# EAGLE design LED_Board (EAGLE 6.4)
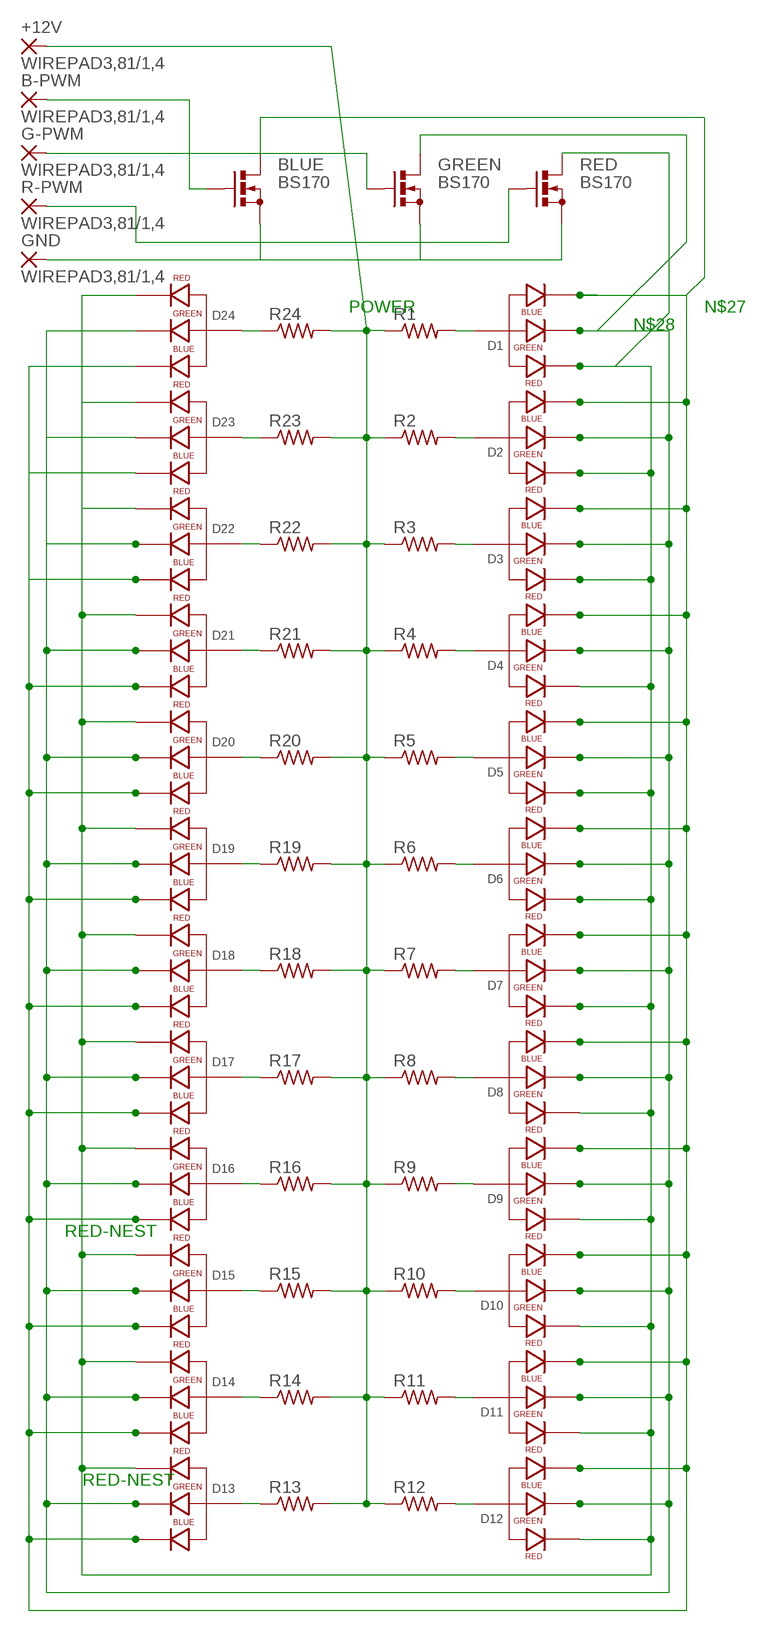
[diagram p0: schematic, sheet 1]

## Parts
+12V  WIREPAD3,81/1,4  [3,81/1,4]
B-PWM  WIREPAD3,81/1,4  [3,81/1,4]
BLUE  BS170  [SOT54E]
D1  LED-RGB-CA-THRUCLEAR  [LED-RGB-THRU]
D2  LED-RGB-CA-THRUCLEAR  [LED-RGB-THRU]
D3  LED-RGB-CA-THRUCLEAR  [LED-RGB-THRU]
D4  LED-RGB-CA-THRUCLEAR  [LED-RGB-THRU]
D5  LED-RGB-CA-THRUCLEAR  [LED-RGB-THRU]
D6  LED-RGB-CA-THRUCLEAR  [LED-RGB-THRU]
D7  LED-RGB-CA-THRUCLEAR  [LED-RGB-THRU]
D8  LED-RGB-CA-THRUCLEAR  [LED-RGB-THRU]
D9  LED-RGB-CA-THRUCLEAR  [LED-RGB-THRU]
D10  LED-RGB-CA-THRUCLEAR  [LED-RGB-THRU]
D11  LED-RGB-CA-THRUCLEAR  [LED-RGB-THRU]
D12  LED-RGB-CA-THRUCLEAR  [LED-RGB-THRU]
D13  LED-RGB-CA-THRUCLEAR  [LED-RGB-THRU]
D14  LED-RGB-CA-THRUCLEAR  [LED-RGB-THRU]
D15  LED-RGB-CA-THRUCLEAR  [LED-RGB-THRU]
D16  LED-RGB-CA-THRUCLEAR  [LED-RGB-THRU]
D17  LED-RGB-CA-THRUCLEAR  [LED-RGB-THRU]
D18  LED-RGB-CA-THRUCLEAR  [LED-RGB-THRU]
D19  LED-RGB-CA-THRUCLEAR  [LED-RGB-THRU]
D20  LED-RGB-CA-THRUCLEAR  [LED-RGB-THRU]
D21  LED-RGB-CA-THRUCLEAR  [LED-RGB-THRU]
D22  LED-RGB-CA-THRUCLEAR  [LED-RGB-THRU]
D23  LED-RGB-CA-THRUCLEAR  [LED-RGB-THRU]
D24  LED-RGB-CA-THRUCLEAR  [LED-RGB-THRU]
G-PWM  WIREPAD3,81/1,4  [3,81/1,4]
GND  WIREPAD3,81/1,4  [3,81/1,4]
GREEN  BS170  [SOT54E]
R1  R-US_0207/10  [0207/10]
R2  R-US_0207/10  [0207/10]
R3  R-US_0207/10  [0207/10]
R4  R-US_0207/10  [0207/10]
R5  R-US_0207/10  [0207/10]
R6  R-US_0207/10  [0207/10]
R7  R-US_0207/10  [0207/10]
R8  R-US_0207/10  [0207/10]
R9  R-US_0207/10  [0207/10]
R10  R-US_0207/10  [0207/10]
R11  R-US_0207/10  [0207/10]
R12  R-US_0207/10  [0207/10]
R13  R-US_0207/10  [0207/10]
R14  R-US_0207/10  [0207/10]
R15  R-US_0207/10  [0207/10]
R16  R-US_0207/10  [0207/10]
R17  R-US_0207/10  [0207/10]
R18  R-US_0207/10  [0207/10]
R19  R-US_0207/10  [0207/10]
R20  R-US_0207/10  [0207/10]
R21  R-US_0207/10  [0207/10]
R22  R-US_0207/10  [0207/10]
R23  R-US_0207/10  [0207/10]
R24  R-US_0207/10  [0207/10]
R-PWM  WIREPAD3,81/1,4  [3,81/1,4]
RED  BS170  [SOT54E]

## Nets
N$1: D4.2(ANODE) R4.2
N$2: BLUE.S GND.1(P) GREEN.S RED.S
N$3: D24.2(ANODE) R24.1
N$4: D23.2(ANODE) R23.1
N$5: D22.2(ANODE) R22.1
N$6: D21.2(ANODE) R21.1
N$7: D20.2(ANODE) R20.1
N$10: D17.2(ANODE) R17.1
N$11: D16.2(ANODE) R16.1
N$12: D15.2(ANODE) R15.1
N$13: D14.2(ANODE) R14.1
N$14: D13.2(ANODE) R13.1
N$15: D1.2(ANODE) R1.2
N$16: D2.2(ANODE) R2.2
N$17: D3.2(ANODE) R3.2
N$19: D5.2(ANODE) R5.2
N$20: D6.2(ANODE) R6.2
N$21: D7.2(ANODE) R7.2
N$22: D8.2(ANODE) R8.2
N$23: D9.2(ANODE) R9.2
N$24: D10.2(ANODE) R10.2
N$25: D12.2(ANODE) R12.2
N$26: D11.2(ANODE) R11.2
N$27: BLUE.D D1.4(BLUE_CATHODE) D2.4(BLUE_CATHODE) D3.4(BLUE_CATHODE) D4.4(BLUE_CATHODE) D5.4(BLUE_CATHODE) D6.4(BLUE_CATHODE) D7.4(BLUE_CATHODE) D8.4(BLUE_CATHODE) D9.4(BLUE_CATHODE) D10.4(BLUE_CATHODE) D11.4(BLUE_CATHODE) D12.4(BLUE_CATHODE) D13.4(BLUE_CATHODE) D14.4(BLUE_CATHODE) D15.4(BLUE_CATHODE) D16.4(BLUE_CATHODE) D17.4(BLUE_CATHODE) D18.4(BLUE_CATHODE) D19.4(BLUE_CATHODE) D20.4(BLUE_CATHODE) D21.4(BLUE_CATHODE) D22.4(BLUE_CATHODE) D23.4(BLUE_CATHODE) D24.4(BLUE_CATHODE)
N$28: D1.3(GREEN_CATHODE) D2.3(GREEN_CATHODE) D3.3(GREEN_CATHODE) D4.3(GREEN_CATHODE) D5.3(GREEN_CATHODE) D6.3(GREEN_CATHODE) D7.3(GREEN_CATHODE) D8.3(GREEN_CATHODE) D9.3(GREEN_CATHODE) D10.3(GREEN_CATHODE) D11.3(GREEN_CATHODE) D12.3(GREEN_CATHODE) D13.3(GREEN_CATHODE) D14.3(GREEN_CATHODE) D15.3(GREEN_CATHODE) D16.3(GREEN_CATHODE) D17.3(GREEN_CATHODE) D18.3(GREEN_CATHODE) D19.3(GREEN_CATHODE) D20.3(GREEN_CATHODE) D21.3(GREEN_CATHODE) D22.3(GREEN_CATHODE) D23.3(GREEN_CATHODE) D24.3(GREEN_CATHODE) GREEN.D
N$30: R-PWM.1(P) RED.G
N$31: G-PWM.1(P) GREEN.G
N$32: B-PWM.1(P) BLUE.G
N$47: D18.2(ANODE) R18.1
N$48: D19.2(ANODE) R19.1
POWER: +12V.1(P) R1.1 R2.1 R3.1 R4.1 R5.1 R6.1 R7.1 R8.1 R9.1 R10.1 R11.1 R12.1 R13.2 R14.2 R15.2 R16.2 R17.2 R18.2 R19.2 R20.2 R21.2 R22.2 R23.2 R24.2
RED-NEST: D1.1(RED_CATHODE) D2.1(RED_CATHODE) D3.1(RED_CATHODE) D4.1(RED_CATHODE) D5.1(RED_CATHODE) D6.1(RED_CATHODE) D7.1(RED_CATHODE) D8.1(RED_CATHODE) D9.1(RED_CATHODE) D10.1(RED_CATHODE) D11.1(RED_CATHODE) D12.1(RED_CATHODE) D13.1(RED_CATHODE) D14.1(RED_CATHODE) D15.1(RED_CATHODE) D16.1(RED_CATHODE) D17.1(RED_CATHODE) D18.1(RED_CATHODE) D19.1(RED_CATHODE) D20.1(RED_CATHODE) D21.1(RED_CATHODE) D22.1(RED_CATHODE) D23.1(RED_CATHODE) D24.1(RED_CATHODE) RED.D

## Library data of the parts
+12V B-PWM G-PWM GND R-PWM = wirepad:WIREPAD: Wire PAD connect wire on PCB
BLUE GREEN RED = transistor-small-signal:BS170: N-CHANNEL MOS FET
D1-D24 = SparkFun-LED:LED-RGB-CA-THRU: RGB Through-hole common anode SparkFun store front COM-10821 (diffuse) COM-10820 (clear); PROD_ID: DIO-10631
R1-R24 = resistor:R-US_: RESISTOR, American symbol

## Board
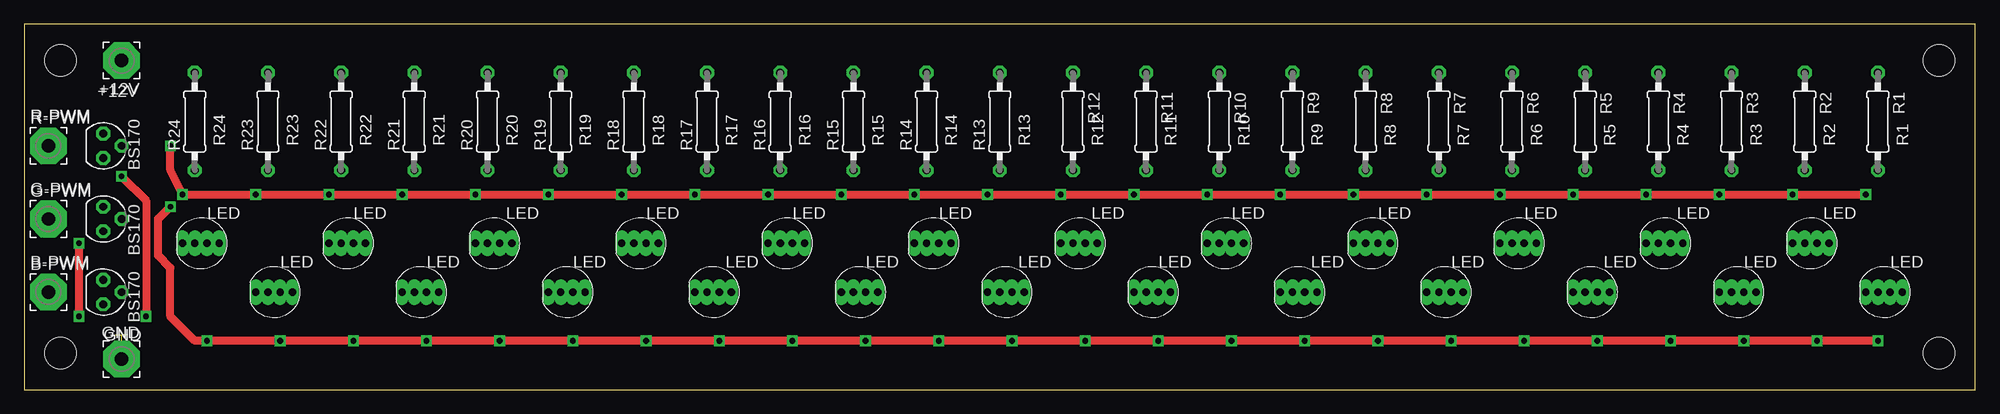
[diagram p1: board, top side]
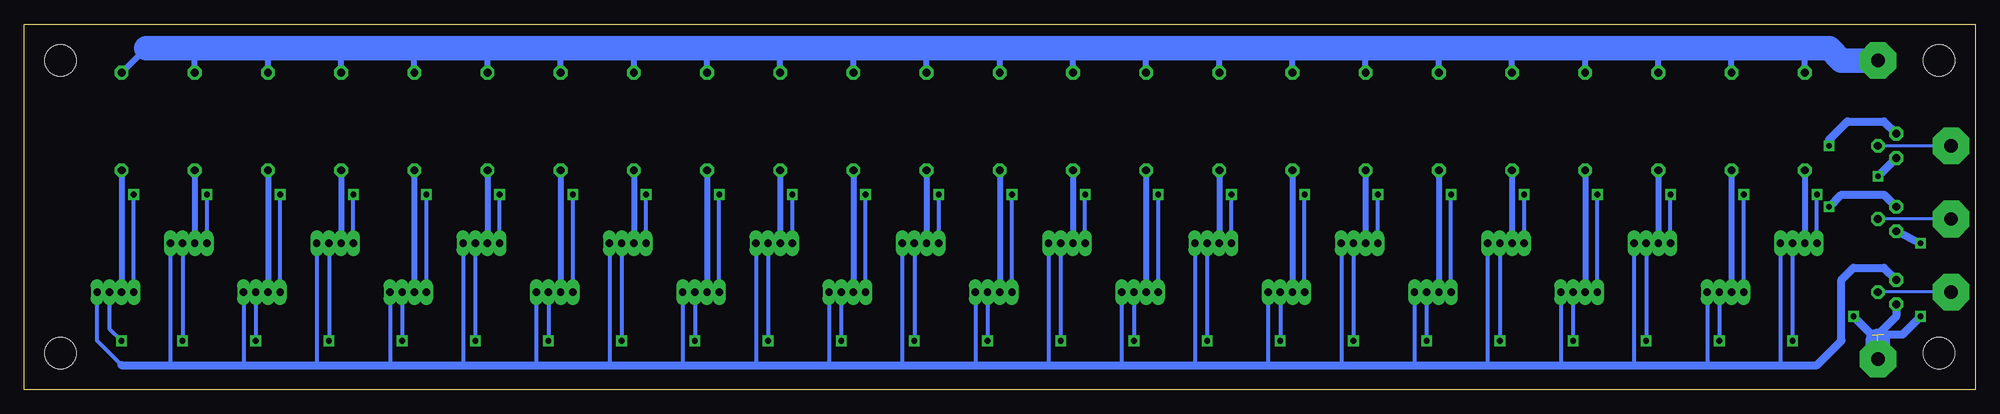
[diagram p2: board, bottom side, seen from below]

Size 203.2 x 38.1 mm. Coordinates in mm from the lower left corner, seen from the top.
Outline: 0,0 203.2,0 203.2,38.1 0,38.1 0,0
Copper layers (1*16): Top 0.035mm / dielectric 1.5mm / Bottom 0.035mm
Design rules "SparkFun": minimum track width 8mil, minimum drill 20mil, track to track 8mil, track to pad 8mil, pad to pad 8mil, via to via 8mil, smd to smd 8mil, copper to edge 10mil, drill to drill 8mil, minimum pad ring 12mil, minimum via ring 10mil, stop-mask expansion 4mil, vias tented up to drill 25mil, thermal gap 10mil

### Footprints (pad centres in the part's own frame; a part is rotated, then mirrored left to right if it is on the bottom)
3,81/1,4 = drill 1.397 pad 3.81 octagon: 1 0,0
SOT54E = drill 0.813 octagon: D -1.27,0; G 0,1.905; S 1.27,0
LED-RGB-THRU = drill 0.762 pad 0.889 long: 1 1.905,0; 2 0.635,0; 3 -0.635,0; 4 -1.905,0
0207/10 = drill 0.813 octagon: 1 -5.08,0; 2 5.08,0
STAND-OFF = hole 3.302: 0,0

### Placement (x,y rotation side)
+12V  10.16,34.29 180 top
B-PWM  2.54,10.16 0 top
BLUE  8.26,10.16 270 top
D1  193.68,10.16 180 top
D2  186.06,15.24 180 top
D3  178.44,10.16 180 top
D4  170.81,15.24 180 top
D5  163.19,10.16 180 top
D6  155.57,15.24 180 top
D7  147.96,10.16 180 top
D8  140.34,15.24 180 top
D9  132.72,10.16 180 top
D10  125.09,15.24 180 top
D11  117.47,10.16 180 top
D12  109.86,15.24 180 top
D13  102.23,10.16 180 top
D14  94.61,15.24 180 top
D15  87,10.16 180 top
D16  79.38,15.24 180 top
D17  71.75,10.16 180 top
D18  64.14,15.24 180 top
D19  56.52,10.16 180 top
D20  48.9,15.24 180 top
D21  41.27,10.16 180 top
D22  33.66,15.24 180 top
D23  26.04,10.16 180 top
D24  18.41,15.24 180 top
G-PWM  2.54,17.78 0 top
GND  10.16,3.17 180 top
GREEN  8.26,17.78 270 top
R1  193.04,27.94 270 top
R2  185.42,27.94 270 top
R3  177.8,27.94 270 top
R4  170.18,27.94 270 top
R5  162.56,27.94 270 top
R6  154.94,27.94 270 top
R7  147.32,27.94 270 top
R8  139.7,27.94 270 top
R9  132.08,27.94 270 top
R10  124.46,27.94 270 top
R11  116.84,27.94 270 top
R12  109.22,27.94 270 top
R13  101.6,27.94 90 top
R14  93.98,27.94 90 top
R15  86.36,27.94 90 top
R16  78.74,27.94 90 top
R17  71.12,27.94 90 top
R18  63.5,27.94 90 top
R19  55.88,27.94 90 top
R20  48.26,27.94 90 top
R21  40.64,27.94 90 top
R22  33.02,27.94 90 top
R23  25.4,27.94 90 top
R24  17.78,27.94 90 top
R-PWM  2.54,25.4 0 top
RED  8.26,25.4 270 top
U$1  [STAND-OFF]  3.81,34.29 0 top
U$2  [STAND-OFF]  3.81,3.81 0 top
U$3  [STAND-OFF]  199.39,34.29 0 top
U$4  [STAND-OFF]  199.39,3.81 0 top

### Tracks (layer width: path | path; a pad name or v marks a point on that pad's centre or on a via)
N$1
  Bottom 0.61: R4.2 D4.2
N$2  (via drill 0.6)  (3 unrouted)
  Top 0.813: v10.16,22.23 12.7,19.68 v12.7,7.62 | v5.71,15.24 v5.71,7.62
  Bottom 0.813: RED.S v10.16,22.23 | GREEN.S v5.71,15.24 | v5.71,7.62 7.62,5.71 9.53,5.71 | BLUE.S 8.26,7.62 10.16,5.71 | v12.7,7.62 10.79,5.71
  Bottom 2.54: GND.1 10.16,5.08
N$3
  Bottom 0.61: R24.1 D24.2
N$4
  Bottom 0.61: R23.1 D23.2
N$5
  Bottom 0.61: R22.1 D22.2
N$6
  Bottom 0.61: R21.1 D21.2
N$7
  Bottom 0.61: R20.1 D20.2
N$10
  Bottom 0.61: R17.1 D17.2
N$11
  Bottom 0.61: R16.1 D16.2
N$12
  Bottom 0.61: R15.1 D15.2
N$13
  Bottom 0.61: R14.1 D14.2
N$14
  Bottom 0.61: R13.1 D13.2
N$15
  Bottom 0.61: R1.2 D1.2
N$16
  Bottom 0.61: R2.2 D2.2
N$17
  Bottom 0.61: R3.2 D3.2
N$19
  Bottom 0.61: R5.2 D5.2
N$20
  Bottom 0.61: R6.2 D6.2
N$21
  Bottom 0.61: R7.2 D7.2
N$22
  Bottom 0.61: R8.2 D8.2
N$23
  Bottom 0.61: R9.2 D9.2
N$24
  Bottom 0.61: R10.2 D10.2
N$25
  Bottom 0.61: R12.2 D12.2
N$26
  Bottom 0.61: R11.2 D11.2
N$27
  Bottom 0.406: D24.4 20.32,2.54 | D23.4 27.94,2.54 | D22.4 35.56,2.54 | D21.4 43.18,2.54 | D20.4 50.8,2.54 | D19.4 58.42,2.54 | D18.4 66.04,2.54 | D17.4 73.66,2.54 | D16.4 81.28,2.54 | D15.4 88.9,2.54 | D14.4 96.52,2.54 | D13.4 104.14,2.54 | D12.4 111.76,2.54 | D11.4 119.38,2.54 | D10.4 127,2.54 | D9.4 134.62,2.54 | D8.4 142.24,2.54 | D7.4 149.86,2.54 | D6.4 157.48,2.54 | D5.4 165.1,2.54 | D4.4 172.72,2.54 | D3.4 180.34,2.54 | D2.4 187.96,2.54 | 193.04,2.54 195.58,5.08 D1.4
  Bottom 0.813: 193.04,2.54 187.96,2.54 180.34,2.54 172.72,2.54 165.1,2.54 157.48,2.54 149.86,2.54 142.24,2.54 134.62,2.54 127,2.54 119.38,2.54 111.76,2.54 104.14,2.54 96.52,2.54 88.9,2.54 81.28,2.54 73.66,2.54 66.04,2.54 58.42,2.54 50.8,2.54 43.18,2.54 35.56,2.54 27.94,2.54 20.32,2.54 16.51,2.54 13.97,5.08 13.97,11.43 12.7,12.7 9.53,12.7 BLUE.D
N$28  (via drill 0.6)
  Top 0.813: v193.04,5.08 v186.69,5.08 v179.07,5.08 v171.45,5.08 v163.83,5.08 v156.21,5.08 v148.59,5.08 v140.97,5.08 v133.35,5.08 v125.73,5.08 v118.11,5.08 v110.49,5.08 v102.87,5.08 v95.25,5.08 v87.63,5.08 v80.01,5.08 v72.39,5.08 v64.77,5.08 v57.15,5.08 v49.53,5.08 v41.91,5.08 v34.29,5.08 v26.67,5.08 v19.05,5.08 17.78,5.08 15.24,7.62 15.24,12.7 13.97,13.97 13.97,17.78 v15.24,19.05
  Bottom 0.406: D2.3 v186.69,5.08 | D3.3 v179.07,5.08 | D4.3 v171.45,5.08 | D5.3 v163.83,5.08 | D6.3 v156.21,5.08 | D7.3 v148.59,5.08 | D8.3 v140.97,5.08 | D9.3 v133.35,5.08 | D10.3 v125.73,5.08 | D11.3 v118.11,5.08 | D12.3 v110.49,5.08 | D13.3 v102.87,5.08 | D14.3 v95.25,5.08 | D15.3 v87.63,5.08 | D16.3 v80.01,5.08 | D17.3 v72.39,5.08 | D18.3 v64.77,5.08 | D19.3 v57.15,5.08 | D20.3 v49.53,5.08 | D21.3 v41.91,5.08 | D22.3 v34.29,5.08 | D23.3 v26.67,5.08 | D24.3 v19.05,5.08 | D1.3 194.31,6.35 v193.04,5.08
  Bottom 0.813: v15.24,19.05 13.97,20.32 9.53,20.32 GREEN.D
N$30
  Bottom 0.305: R-PWM.1 RED.G
N$31
  Bottom 0.305: G-PWM.1 GREEN.G
N$32
  Bottom 0.305: B-PWM.1 BLUE.G
N$47
  Bottom 0.61: R18.1 D18.2
N$48
  Bottom 0.61: R19.1 D19.2
POWER
  Bottom 0.61: R24.2 17.78,35.56 | R23.2 25.4,35.56 | R22.2 33.02,35.56 | R21.2 40.64,35.56 | R20.2 48.26,35.56 | R19.2 55.88,35.56 | R18.2 63.5,35.56 | R17.2 71.12,35.56 | R16.2 78.74,35.56 | R15.2 86.36,35.56 | R14.2 93.98,35.56 | R13.2 101.6,35.56 | R12.1 109.22,35.56 | R11.1 116.84,35.56 | R10.1 124.46,35.56 | R9.1 132.08,35.56 | R8.1 139.7,35.56 | R7.1 147.32,35.56 | R6.1 154.94,35.56 | R5.1 162.56,35.56 | R4.1 170.18,35.56 | R3.1 177.8,35.56 | R2.1 185.42,35.56 | 190.5,35.56 R1.1
  Bottom 2.54: +12V.1 13.97,34.29 15.24,35.56 17.78,35.56 25.4,35.56 33.02,35.56 40.64,35.56 48.26,35.56 55.88,35.56 63.5,35.56 71.12,35.56 78.74,35.56 86.36,35.56 93.98,35.56 101.6,35.56 109.22,35.56 116.84,35.56 124.46,35.56 132.08,35.56 139.7,35.56 147.32,35.56 154.94,35.56 162.56,35.56 170.18,35.56 177.8,35.56 185.42,35.56 190.5,35.56
RED-NEST  (via drill 0.6)
  Top 0.813: v191.77,20.32 v184.15,20.32 v176.53,20.32 v168.91,20.32 v161.29,20.32 v153.67,20.32 v146.05,20.32 v138.43,20.32 v130.81,20.32 v123.19,20.32 v115.57,20.32 v107.95,20.32 v100.33,20.32 v92.71,20.32 v85.09,20.32 v77.47,20.32 v69.85,20.32 v62.23,20.32 v54.61,20.32 v46.99,20.32 v39.37,20.32 v31.75,20.32 v24.13,20.32 v16.51,20.32 15.24,22.86 v15.24,25.4
  Bottom 0.406: D24.1 v16.51,20.32 | D23.1 v24.13,20.32 | D22.1 v31.75,20.32 | D21.1 v39.37,20.32 | D20.1 v46.99,20.32 | D19.1 v54.61,20.32 | D18.1 v62.23,20.32 | D17.1 v69.85,20.32 | D16.1 v77.47,20.32 | D15.1 v85.09,20.32 | D14.1 v92.71,20.32 | D13.1 v100.33,20.32 | D12.1 v107.95,20.32 | D11.1 v115.57,20.32 | D10.1 v123.19,20.32 | D9.1 v130.81,20.32 | D8.1 v138.43,20.32 | D7.1 v146.05,20.32 | D6.1 v153.67,20.32 | D5.1 v161.29,20.32 | D4.1 v168.91,20.32 | D3.1 v176.53,20.32 | D2.1 v184.15,20.32 | D1.1 v191.77,20.32
  Bottom 0.813: v15.24,25.4 15.24,26.04 13.34,27.94 9.53,27.94 RED.D

### Text on the board
tPlace: +12V | R-PWM | R-PWM | R24 | R23 | R22 | R21 | R20 | R19 | R18 | R17 | R16 | R15 | R14 | R13 | R12 | R11 | R10 | R9 | R8 | R7 | R6 | R5 | R4 | R3 | R2 | R1 | BS170 | G-PWM | LED | LED | LED | LED | LED | LED | LED | LED | LED | LED | LED | LED | BS170 | B-PWM | LED | LED | LED | LED | LED | LED | LED | LED | LED | LED | LED | LED | BS170 | GND